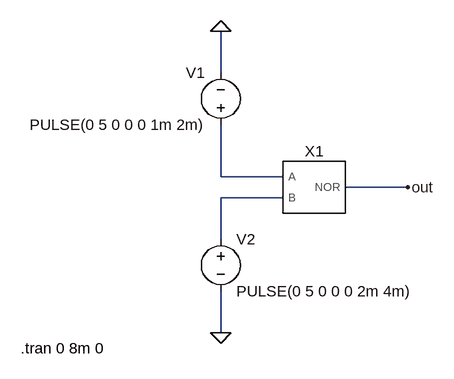
[diagram p0: schematic NOR_TB.asc]
NOR_TB.asc, the LTspice schematic file:
Version 4
SHEET 1 880 680
WIRE 64 -16 64 -80
WIRE 64 144 64 64
WIRE 160 144 64 144
WIRE 352 160 256 160
WIRE 160 176 64 176
WIRE 64 240 64 176
WIRE 64 384 64 320
FLAG 64 384 0
FLAG 64 -80 0
FLAG 352 160 out
SYMBOL NOR 208 160 R0
SYMATTR InstName X1
SYMBOL voltage 64 80 R180
WINDOW 0 24 96 Left 2
WINDOW 3 24 16 Left 2
WINDOW 123 0 0 Left 0
WINDOW 39 0 0 Left 0
SYMATTR InstName V1
SYMATTR Value PULSE(0 5 0 0 0 1m 2m)
SYMBOL voltage 64 224 R0
WINDOW 123 0 0 Left 0
WINDOW 39 0 0 Left 0
SYMATTR InstName V2
SYMATTR Value PULSE(0 5 0 0 0 2m 4m)
TEXT -244 408 Left 2 !.tran 0 8m 0

The netlist it stands for:
* NOR_TB.asc
XX1 N001 N002 out NOR  ; pins A B NOR
V1 N001 0 PULSE(0 5 0 0 0 1m 2m)
V2 N002 0 PULSE(0 5 0 0 0 2m 4m)
.tran 0 8m 0
.backanno
.end